# Altium schematic sheet LED_Chaser_IO_Module.SchDoc
size B; Organization: Altium Limited; Address1: L3, 12a Rodborough Rd; Address2: Frenchs Forest; Address3: NSW; Address4: Australia 2086; DocumentNumber: 1; SheetNumber: 1; SheetTotal: 1
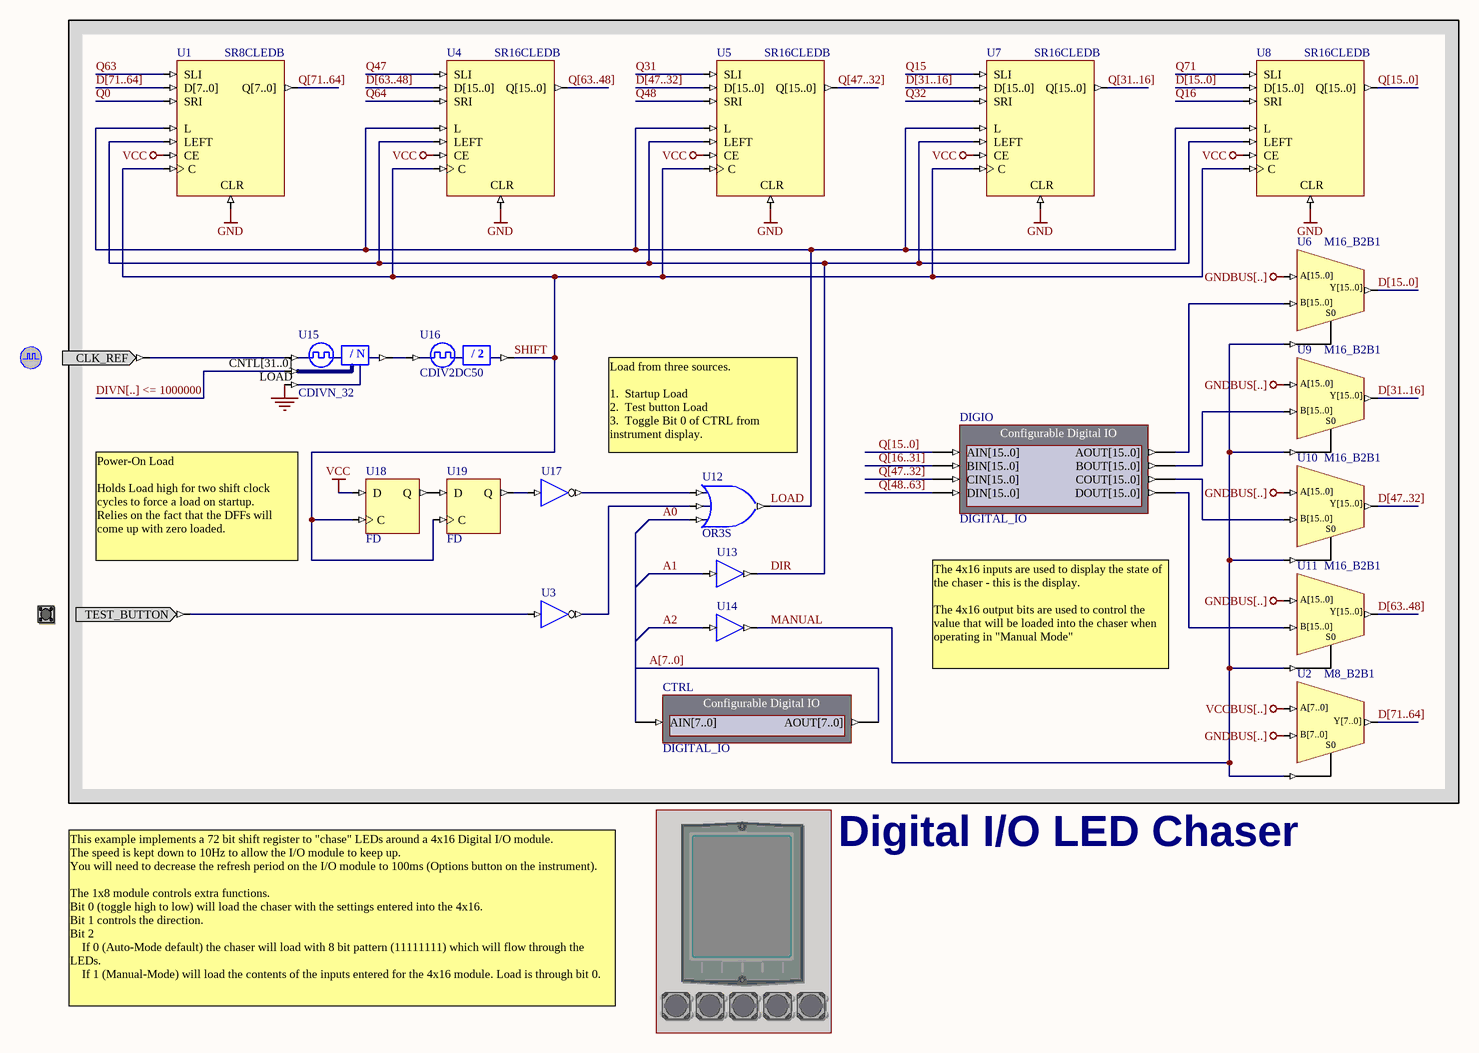
[diagram p0: LED_Chaser_IO_Module.SchDoc]

## Parts
(Parts that share a designator on the sheet are numbered #1, #2 ... from top to bottom, then left to right.)
?#1  CLOCK_REFERENCE  (value not drawn)
?#2  TEST_BUTTON  (value not drawn)
?#3  FIRMWARE_TFT_ENABLE  (value not drawn)  (masked out: inside a compile mask, not in the netlist)
?#4  FIRMWARE_BUTTONS_ENABLE  (value not drawn)  (masked out: inside a compile mask, not in the netlist)
CTRL  DIGITAL_IO
DIGIO  DIGITAL_IO
U1  SR8CLEDB
U2  M8_B2B1
U3  INV  (value not drawn)
U4  SR16CLEDB
U5  SR16CLEDB
U6  M16_B2B1
U7  SR16CLEDB
U8  SR16CLEDB
U9  M16_B2B1
U10  M16_B2B1
U11  M16_B2B1
U12  OR3S
U13  BUF  (value not drawn)
U14  BUF  (value not drawn)
U15  CDIVN_32
U16  CDIV2DC50
U17  INV  (value not drawn)
U18  FD
U19  FD

## Nets
GND: U1.CLR U4.CLR U5.CLR U7.CLR U8.CLR U15.LOAD
GNDBUS[..]: U2.B[7..0] U6.A[15..0] U9.A[15..0] U10.A[15..0] U11.A[15..0]
VCC: U1.CE U4.CE U5.CE U7.CE U8.CE U18.D
VCCBUS[..]: U2.A[7..0]
A0: U12.I2
A1: U13.I
A2: U14.I
A[7..0]: CTRL.AIN[7..0] CTRL.AOUT[7..0]
D[15..0]: U6.Y[15..0] U8.D[15..0]
D[31..16]: U7.D[15..0] U9.Y[15..0]
D[47..32]: U5.D[15..0] U10.Y[15..0]
D[63..48]: U4.D[15..0] U11.Y[15..0]
D[71..64]: U1.D[7..0] U2.Y[7..0]
DIR: U1.LEFT U4.LEFT U5.LEFT U7.LEFT U8.LEFT U13.O
DIVN[..] <= 1000000: U15.CNTL[31..0]
LOAD: U1.L U4.L U5.L U7.L U8.L U12.O
MANUAL: U2.S0 U6.S0 U9.S0 U10.S0 U11.S0 U14.O
Q0: U1.SRI
Q15: U7.SLI
Q16: U8.SRI
Q31: U5.SLI
Q32: U7.SRI
Q47: U4.SLI
Q48: U5.SRI
Q63: U1.SLI
Q64: U4.SRI
Q71: U8.SLI
Q[15..0]: DIGIO.AIN[15..0] U8.Q[15..0]
Q[16..31]: DIGIO.BIN[15..0]
Q[31..16]: U7.Q[15..0]
Q[47..32]: DIGIO.CIN[15..0] U5.Q[15..0]
Q[48..63]: DIGIO.DIN[15..0]
Q[63..48]: U4.Q[15..0]
Q[71..64]: U1.Q[7..0]
SHIFT: U1.C U4.C U5.C U7.C U8.C U16.CLKDV U18.C U19.C
Net?#1_CLK_REF: ?#1.CLK_REF U15.CLKIN
Net?#2_TEST_BUTTON: ?#2.TEST_BUTTON U3.I
NetDIGIO_AOUT[15..0]: DIGIO.AOUT[15..0] U6.B[15..0]
NetDIGIO_BOUT[15..0]: DIGIO.BOUT[15..0] U9.B[15..0]
NetDIGIO_COUT[15..0]: DIGIO.COUT[15..0] U10.B[15..0]
NetDIGIO_DOUT[15..0]: DIGIO.DOUT[15..0] U11.B[15..0]
NetU3_O: U3.O U12.I1
NetU12_I0: U12.I0 U17.O
NetU15_CLKDV: U15.CLKDV U16.CLKIN
NetU17_I: U17.I U19.Q
NetU18_Q: U18.Q U19.D

## Buses and harness runs
bus A[7..0]
bus D[15..0]
bus D[31..16]
bus D[47..32]
bus D[63..48]
bus D[71..64]
bus DIVN[..] <= 1000000
bus Q[15..0]
bus Q[16..31]
bus Q[31..16]
bus Q[47..32]
bus Q[48..63]
bus Q[63..48]
bus Q[71..64]

## Notes on the sheet
- Load from three sources.
  1.  Startup Load
  2.  Test button Load
  3.  Toggle Bit 0 of CTRL from instrument display.
- Power-On Load
  Holds Load high for two shift clock cycles to force a load on startup.
  Relies on the fact that the DFFs will come up with zero loaded.
- The 4x16 inputs are used to display the state of the chaser - this is the display.
  The 4x16 output bits are used to control the value that will be loaded into the chaser when operating in "Manual Mode"
- (near U2) Digital I/O LED Chaser
- This example implements a 72 bit shift register to "chase" LEDs around a 4x16 Digital I/O module.
  The speed is kept down to 10Hz to allow the I/O module to keep up.
  You will need to decrease the refresh period on the I/O module to 100ms (Options button on the instrument).
  The 1x8 module controls extra functions.
  Bit 0 (toggle high to low) will load the chaser with the settings entered into the 4x16.
  Bit 1 controls the direction.
  Bit 2
  If 0 (Auto-Mode default) the chaser will load with 8 bit pattern (11111111) which will flow through the LEDs.
  If 1 (Manual-Mode) will load the contents of the inputs entered for the 4x16 module. Load is through bit 0.
- Title
- Size:
- Date:
- B
- Number:
- Time:
- Revision:
- Sheet
- of
- File:
- (in symbol CDIV2DC50) / 2
- (in symbol CDIVN_32) / N

## Library data of the parts
?#1 = CLOCK_REFERENCE: Global System Clock Reference Supply; PortComponent: True; Published: 19-Nov-2003; Publisher: Altium Limited; HelpURL: TR0143 Technical Reference Manual for Altium's Desktop NanoBoard NB2DSK01.pdf#page=41
?#2 = TEST_BUTTON: Test / Reset Button; PortComponent: True; Published: 19-Nov-2003; Publisher: Altium Limited; HelpURL: TR0143 Technical Reference Manual for Altium's Desktop NanoBoard NB2DSK01.pdf#page=53
?#3 = FIRMWARE_TFT_ENABLE: TFT LCD Panel; PortComponent: True; Published: 22-Jan-2007; Publisher: Altium Limited; HelpURL: TR0143 Technical Reference Manual for Altium's Desktop NanoBoard NB2DSK01.pdf#page=50
?#4 = FIRMWARE_BUTTONS_ENABLE: Generic User Buttons; PortComponent: True; Published: 16-Apr-2007; Publisher: Altium Limited; HelpURL: TR0143 Technical Reference Manual for Altium's Desktop NanoBoard NB2DSK01.pdf#page=53
CTRL = DIGITAL_IO: Configurable Digital IO; NEXUS_CORE: Instrument; NEXUS_JTAG_DEVICE: True; NEXUS_JTAG_ORDER: 0; ConfigurationParameters: {}Version[1.0]{}Input0Name[AIN{1}7..0{2}]{}Input0Width[8]{}Input0InitValue[0]{}Input0Kind[LEDs]{}Input0LEDStyle[Red]{}Output0Name[AOUT{1}7..0{2}]{}Output0Width[8]{}Output0InitValue[0]{}Output0Kind[Numeric]{}Output0NumRadix[Binary]{}; ConfiguratorName: DIGITAL_IO; ComponentLink1Description: Core &Resource Usage; ComponentLink1URL: CR0134 FPGA Instrument Resource Usage.pdf; Core Revision: 1.00.00; HelpURL: CR0179 DIGITAL_IO Configurable Digital IO Module.pdf; LastRevisionNo: 1.00.00; Published: 28-Jun-2007; Publisher: Altium Limited; UseInDSF: True
DIGIO = DIGITAL_IO: Configurable Digital IO; NEXUS_CORE: Instrument; NEXUS_JTAG_DEVICE: True; NEXUS_JTAG_ORDER: 0; ConfigurationParameters: {}Version[1.0]{}Input0Name[AIN{1}15..0{2}]{}Input0Width[16]{}Input0InitValue[0]{}Input0Kind[LEDs]{}Input0LEDStyle[Red]{}Input1Name[BIN{1}15..0{2}]{}Input1Width[16]{}Input1InitValue[0]{}Input1Kind[LEDs]{}Input1LEDStyle[Red]{}Input2Name[CIN{1}15..0{2}]{}Input2Width[16]{}Input2InitValue[0]{}Input2Kind[LEDs]{}Input2LEDStyle[Red]{}Input3Name[DIN{1}15..0{2}]{}Input3Width[16]{}Input3InitValue[0]{}Input3Kind[LEDs]{}Input3LEDStyle[Red]{}Output0Name[AOUT{1}15..0{2}]{}Output0Width[16]{}Output0InitValue[0]{}Output0Kind[Numeric]{}Output0NumRadix[Binary]{}Output1Name[BOUT{1}15..0{2}]{}Output1Width[16]{}Output1InitValue[0]{}Output1Kind[Numeric]{}Output1NumRadix[Binary]{}Output2Name[COUT{1}15..0{2}]{}Output2Width[16]{}Output2InitValue[0]{}Output2Kind[Numeric]{}Output2NumRadix[Binary]{}Output3Name[DOUT{1}15..0{2}]{}Output3Width[16]{}Output3InitValue[0]{}Output3Kind[Numeric]{}Output3NumRadix[Binary]{}; ConfiguratorName: DIGITAL_IO; ComponentLink1Description: Core &Resource Usage; ComponentLink1URL: CR0134 FPGA Instrument Resource Usage.pdf; Core Revision: 1.00.00; HelpURL: CR0179 DIGITAL_IO Configurable Digital IO Module.pdf; LastRevisionNo: 1.00.00; Published: 28-Jun-2007; Publisher: Altium Limited; UseInDSF: True
U1 = SR8CLEDB: 8-Bit Shift Registers with Clock Enable and Asynchronous Clear, Bus Version; ArchiveName: GENERIC; Published: 18-Dec-2003; Publisher: Altium Limited; Xilinx Equivalent: SR8CLED; Core Revision: 1.00.00
U2 = M8_B2B1: 2x8-Bit Bus to 1x8-Bit Bus Multiplexer; ArchiveName: GENERIC; Published: 18-Dec-2003; Publisher: Altium Limited; Core Revision: 1.00.00
U3 U17 = INV: Inverter; ArchiveName: GENERIC; Published: 18-Nov-2003; Publisher: Altium Limited; Xilinx Equivalent: INV; Core Revision: 1.00.00
U4 U5 U7 U8 = SR16CLEDB: 16-Bit Shift Registers with Clock Enable and Asynchronous Clear, Bus Version; ArchiveName: GENERIC; Published: 18-Dec-2003; Publisher: Altium Limited; Xilinx Equivalent: SR16CLED; Core Revision: 1.00.00
U6 U9-U11 = M16_B2B1: 2x16-Bit Bus to 1x16-Bit Bus Multiplexer; ArchiveName: GENERIC; Published: 18-Dec-2003; Publisher: Altium Limited; Core Revision: 1.00.00
U12 = OR3S: 3-Input OR Gate, Single Pin Version; Xilinx Equivalent: OR3; ArchiveName: GENERIC; Published: 18-Dec-2003; Publisher: Altium Limited; Core Revision: 1.00.00
U13 U14 = BUF: 1-bit General Purpose (Non-inverting) Buffer; ArchiveName: GENERIC; Published: 18-Dec-2003; Publisher: Altium Limited; Xilinx Equivalent: BUF; Core Revision: 1.00.00
U15 = CDIVN_32: 32-Bit Programmable Clock Divider; ArchiveName: GENERIC; Published: 18-Dec-2003; Publisher: Altium Limited; Core Revision: 1.00.00
U16 = CDIV2DC50: Clock Divider by 2 with 50% Duty Cycle Output; Xilinx Equivalent: CLK_DIV2; ArchiveName: GENERIC; Published: 18-Dec-2003; Publisher: Altium Limited; Core Revision: 1.00.00
U18 U19 = FD: D-Type Flip-Flop; ArchiveName: GENERIC; Published: 18-Dec-2003; Publisher: Altium Limited; Xilinx Equivalent: FD; Core Revision: 1.00.00